# Altium schematic sheet SG_CAN_System.SchDoc
size A
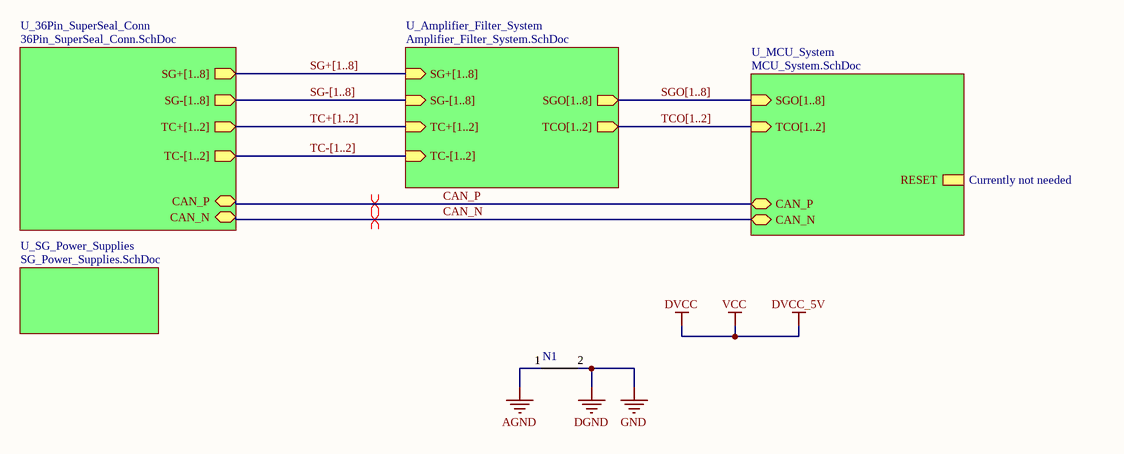
[diagram p0: SG_CAN_System.SchDoc]

## Parts
N1  (no value)  [Net_Tie]

## Sub-sheets
U_36Pin_SuperSeal_Conn = 36Pin_SuperSeal_Conn.SchDoc: SG+[1..8] (out), SG-[1..8] (out), CAN_P (bidir), CAN_N (bidir), TC+[1..2] (out), TC-[1..2] (out)
U_Amplifier_Filter_System = Amplifier_Filter_System.SchDoc: SG+[1..8] (in), SG-[1..8] (in), SGO[1..8] (out), TC+[1..2] (in), TC-[1..2] (in), TCO[1..2] (out)
U_MCU_System = MCU_System.SchDoc: SGO[1..8] (in), TCO[1..2] (in), CAN_P (bidir), CAN_N (bidir), RESET
U_SG_Power_Supplies = SG_Power_Supplies.SchDoc: no entries

## Nets
AGND: N1.1
DGND: N1.2  [also labelled GND]
CAN_N: sheet U_MCU_System/CAN_N, sheet U_36Pin_SuperSeal_Conn/CAN_N
CAN_P: sheet U_MCU_System/CAN_P, sheet U_36Pin_SuperSeal_Conn/CAN_P

## Buses and harness runs
bus SG+[1..8] = sheet U_36Pin_SuperSeal_Conn/SG+[1..8] = sheet U_Amplifier_Filter_System/SG+[1..8]
bus SG-[1..8] = sheet U_36Pin_SuperSeal_Conn/SG-[1..8] = sheet U_Amplifier_Filter_System/SG-[1..8]
bus SGO[1..8] = sheet U_Amplifier_Filter_System/SGO[1..8] = sheet U_MCU_System/SGO[1..8]
bus TC+[1..2] = sheet U_36Pin_SuperSeal_Conn/TC+[1..2] = sheet U_Amplifier_Filter_System/TC+[1..2]
bus TC-[1..2] = sheet U_36Pin_SuperSeal_Conn/TC-[1..2] = sheet U_Amplifier_Filter_System/TC-[1..2]
bus TCO[1..2] = sheet U_Amplifier_Filter_System/TCO[1..2] = sheet U_MCU_System/TCO[1..2]

## Layout directives
differential pair: CAN_N, CAN_P

## Notes on the sheet
- Currently not needed

## Library data of the parts
N1 = 1: Manufacturer_id: 1; idFuse: 3; Name: Net Tie; Drawer_id: 1; idShunt: 1